# EAGLE design Main Board (EAGLE 8.7.0)

## Sheet 1 of 2
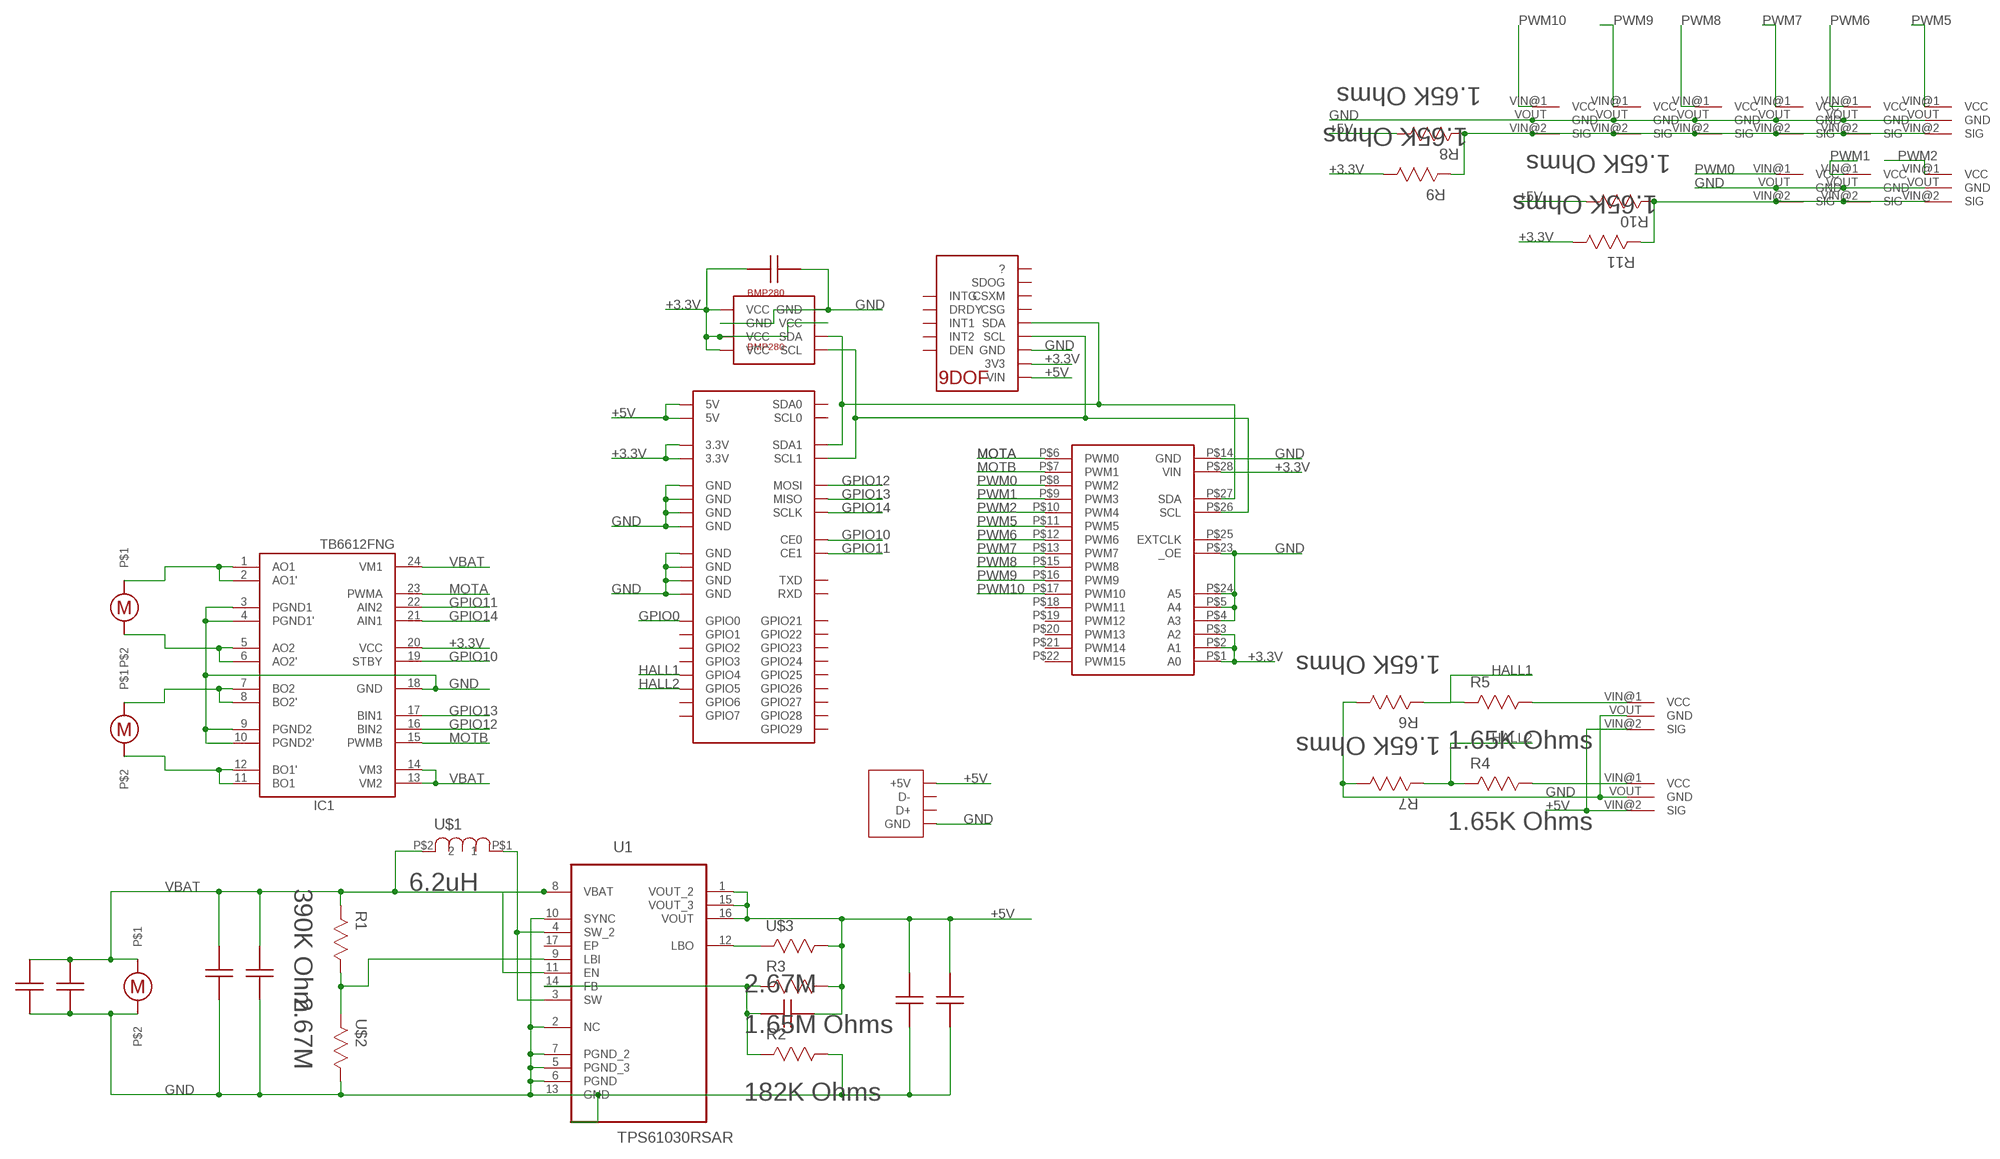
[diagram p0: schematic, sheet 1]

### Parts
IC1  TB6612FNG  [SSOP24]
R1  390K Ohm  CRCW0805390KJNEA  [RESC2013X65N]
R2  182K Ohms  CRCW0805182KFKEA  [RESC2013X65N]
R3  1.65M Ohms  CRCW06031M65FKEA  [RESC1608X60N]
R4  1.65K Ohms  CRCW06031K65FKEA  [RESC1608X60N]
R5  1.65K Ohms  CRCW06031K65FKEA  [RESC1608X60N]
R6  1.65K Ohms  CRCW06031K65FKEA  [RESC1608X60N]
R7  1.65K Ohms  CRCW06031K65FKEA  [RESC1608X60N]
R8  1.65K Ohms  CRCW06031K65FKEA  [RESC1608X60N]
R9  1.65K Ohms  CRCW06031K65FKEA  [RESC1608X60N]
R10  1.65K Ohms  CRCW06031K65FKEA  [RESC1608X60N]
R11  1.65K Ohms  CRCW06031K65FKEA  [RESC1608X60N]
U1  TPS61030RSAR  [QFN65P400X400X100-17N]
U$1  6.2uH  SRU1038-6R2Y  [SRU1038-6R2Y]
U$2  2.67M  CRCW04022M67FKED  [RESC1005X40N]
U$3  2.67M  CRCW04022M67FKED  [RESC1005X40N]
U$4  10pF  0603CAP  [0603]
U$5  MOTOR  [MOTOR_PAD]
U$6  9DOF  [9DOF]
U$7  0603CAP  [0603]
U$8  USB_VERTICLE  [USB_VERTICLE]
U$9  0805CAP  [RESC2013X45N]
U$10  0805CAP  [RESC2013X45N]
U$11  PI  [PI_HEADER_SMD]
U$12  220  [220]
U$13  BMP280  [BMP280]
U$14  0603CAP  [0603]
U$15  PJUMP  [JUMPER]
U$16  PJUMP  [JUMPER]
U$17  PJUMP  [JUMPER]
U$18  220  [220]
U$19  220  [220]
U$20  MOTOR  [MOTOR_PAD]
U$21  MOTOR  [MOTOR_PAD]
U$22  PJUMP  [JUMPER]
U$23  PJUMP  [JUMPER]
U$24  PJUMP  [JUMPER]
U$25  PJUMP  [JUMPER]
U$26  PJUMP  [JUMPER]
U$27  PWM  [TSSOP28]
U$28  PJUMP  [JUMPER]
U$29  PJUMP  [JUMPER]
U$30  PJUMP  [JUMPER]

### Nets
+3.3V: IC1.20(VCC) R9.1 R11.1 U$6.P$21(3V3) U$11.3.3V@1(3.3V) U$11.3.3V@17(3.3V) U$13.P$2(VCC) U$13.P$5(VCC) U$13.P$6(VCC) U$13.P$8(VCC) U$14.P$1 U$27.P$1(A0) U$27.P$2(A1) U$27.P$3(A2) U$27.P$28(VIN)
+5V: R3.1 R8.1 R10.1 U1.1(VOUT_2) U1.15(VOUT_3) U1.16(VOUT) U$3.1 U$4.P$2 U$6.P$20(VIN) U$8.VCC(+5V) U$9.1 U$11.5V@2(5V) U$11.5V@4(5V) U$12.P$1 U$15.VIN@2(SIG) U$16.VIN@2(SIG)
GND: IC1.3(PGND1) IC1.4(PGND1') IC1.9(PGND2) IC1.10(PGND2') IC1.18(GND) R2.1 R6.1 R7.1 U1.2(NC) U1.5(PGND_3) U1.6(PGND) U1.7(PGND_2) U1.10(SYNC) U1.13(GND) U$2.1 U$6.P$22(GND) U$7.P$2 U$8.GND@1(GND) U$8.GND@2(GND) U$8.GND@3(GND) U$9.2 U$10.2 U$11.GND@6(GND) U$11.GND@9(GND) U$11.GND@14(GND) U$11.GND@20(GND) U$11.GND@25(GND) U$11.GND@30(GND) U$11.GND@34(GND) U$11.GND@39(GND) U$12.P$2 U$13.P$1(GND) U$13.P$7(GND) U$14.P$2 U$15.VOUT(GND) U$16.VOUT(GND) U$17.VOUT(GND) U$18.P$2 U$19.P$2 U$21.P$2 U$22.VOUT(GND) U$23.VOUT(GND) U$24.VOUT(GND) U$25.VOUT(GND) U$26.VOUT(GND) U$27.P$4(A3) U$27.P$5(A4) U$27.P$14(GND) U$27.P$23(_OE) U$27.P$24(A5) U$28.VOUT(GND) U$29.VOUT(GND) U$30.VOUT(GND)
GPIO0: U$11.GPIO0
GPIO10: IC1.19(STBY) U$11.CE0
GPIO11: IC1.22(AIN2) U$11.CE1
GPIO12: IC1.16(BIN2) U$11.MOSI
GPIO13: IC1.17(BIN1) U$11.MISO
GPIO14: IC1.21(AIN1) U$11.SCLK
HALL1: R5.2 R6.2 U$11.GPIO4
HALL2: R4.2 R7.2 U$11.GPIO5
MOTA: IC1.23(PWMA) U$27.P$6(PWM0)
MOTB: IC1.15(PWMB) U$27.P$7(PWM1)
N$1: R1.1 U1.9(LBI) U$2.2
N$2: U1.3(SW) U1.4(SW_2) U$1.P$1
N$3: R8.2 R9.2 U$17.VIN@2(SIG) U$22.VIN@2(SIG) U$23.VIN@2(SIG) U$24.VIN@2(SIG) U$25.VIN@2(SIG) U$26.VIN@2(SIG)
N$5: R5.1 U$15.VIN@1(VCC)
N$6: R4.1 U$16.VIN@1(VCC)
N$7: U1.12(LBO) U$3.2
N$8: R10.2 R11.2 U$28.VIN@2(SIG) U$29.VIN@2(SIG) U$30.VIN@2(SIG)
N$10: U$6.P$23(SCL) U$11.SCL1 U$13.P$4(SCL) U$27.P$26(SCL)
N$11: R2.2 R3.2 U1.14(FB) U$4.P$1
N$12: U$6.P$24(SDA) U$11.SDA1 U$13.P$3(SDA) U$27.P$27(SDA)
N$16: IC1.1(AO1) IC1.2(AO1') U$20.P$1
N$17: IC1.5(AO2) IC1.6(AO2') U$20.P$2
N$18: IC1.7(BO2) IC1.8(BO2') U$5.P$1
N$19: IC1.11(BO1) IC1.12(BO1') U$5.P$2
PWM0: U$27.P$8(PWM2) U$30.VIN@1(VCC)
PWM1: U$27.P$9(PWM3) U$29.VIN@1(VCC)
PWM2: U$27.P$10(PWM4) U$28.VIN@1(VCC)
PWM5: U$17.VIN@1(VCC) U$27.P$11(PWM5)
PWM6: U$22.VIN@1(VCC) U$27.P$12(PWM6)
PWM7: U$23.VIN@1(VCC) U$27.P$13(PWM7)
PWM8: U$24.VIN@1(VCC) U$27.P$15(PWM8)
PWM9: U$25.VIN@1(VCC) U$27.P$16(PWM9)
PWM10: U$26.VIN@1(VCC) U$27.P$17(PWM10)
VBAT: IC1.13(VM2) IC1.14(VM3) IC1.24(VM1) R1.2 U1.8(VBAT) U1.11(EN) U$1.P$2 U$7.P$1 U$10.1 U$18.P$1 U$19.P$1 U$21.P$1
Unconnected: U1.17(EP) U$6.P$15(DEN) U$6.P$16(INT2) U$6.P$17(INT1) U$6.P$18(DRDY) U$6.P$19(INTG) U$6.P$25(CSG) U$6.P$26(CSXM) U$6.P$27(SDOG) U$6.P$28(?) U$8.D+ U$8.D- U$11.GPIO1 U$11.GPIO2 U$11.GPIO3 U$11.GPIO6 U$11.GPIO7 U$11.GPIO21 U$11.GPIO22 U$11.GPIO23 U$11.GPIO24 U$11.GPIO25 U$11.GPIO26 U$11.GPIO27 U$11.GPIO28 U$11.GPIO29 U$11.RXD U$11.SCL0 U$11.SDA0 U$11.TXD U$27.P$18(PWM11) U$27.P$19(PWM12) U$27.P$20(PWM13) U$27.P$21(PWM14) U$27.P$22(PWM15) U$27.P$25(EXTCLK)

## Sheet 2 of 2

## Library data of the parts
IC1 = Adafruit:TB6612FNG: TB6612FNG MOS dual H-bridge motor driver, 1.2A current 3.2A peak 3 or 5v logic and 3-15v motor
R1 = Vishay:CRCW0805390KJNEA: RESISTOR, 0805; MPN: CRCW0805390KJNEA; OC_FARNELL: -; OC_NEWARK: 59M6896; SUPPLIER: VISHAY DALE ELECTRONICS; TOLERANCE: ±5%; WATTAGE: 0.125 W
R2 = Vishay:CRCW0805182KFKEA: RESISTOR, 0805; MPN: CRCW0805182KFKEA; OC_FARNELL: 1652932; OC_NEWARK: 52K9931; SUPPLIER: Vishay; TOLERANCE: ±1%; WATTAGE: 0.125 W
R3 = Vishay:CRCW06031M65FKEA: RESISTOR, 0603; MPN: CRCW06031M65FKEA; OC_FARNELL: 1570712; OC_NEWARK: 89M6723; SUPPLIER: Vishay; TOLERANCE: ±1%; WATTAGE: 0.1 W
R4-R11 = Vishay:CRCW06031K65FKEA: RESISTOR, 0603; MPN: CRCW06031K65FKEA; OC_FARNELL: 1151619; OC_NEWARK: 52K8043; SUPPLIER: VISHAY DALE ELECTRONICS; TOLERANCE: ±1%; WATTAGE: 0.1 W
U1 = Texas Instruments:TPS61030RSAR: SYNCHRONOUS BOOST CONVERTER; MPN: TPS61030RSAR; OC_FARNELL: 1813710; OC_NEWARK: 90H4859; PACKAGE: QFN-16; SUPPLIER: Texas Instruments
U$1 = GoatFinder:SRU1038-6R2Y
U$2 U$3 = Vishay:CRCW04022M67FKED
U$4 U$7 U$14 = GoatFinder:0603CAP
U$5 U$20 U$21 = GoatFinder:MOTOR
U$6 = GoatFinder:9DOF
U$8 = GoatFinder:USB_VERTICLE
U$9 U$10 = GoatFinder:0805CAP
U$11 = GoatFinder:PI
U$12 U$18 U$19 = GoatFinder:220
U$13 = GoatFinder:BMP280
U$15-U$17 U$22-U$26 U$28-U$30 = GoatFinder:PJUMP
U$27 = GoatFinder:PWM

## Board
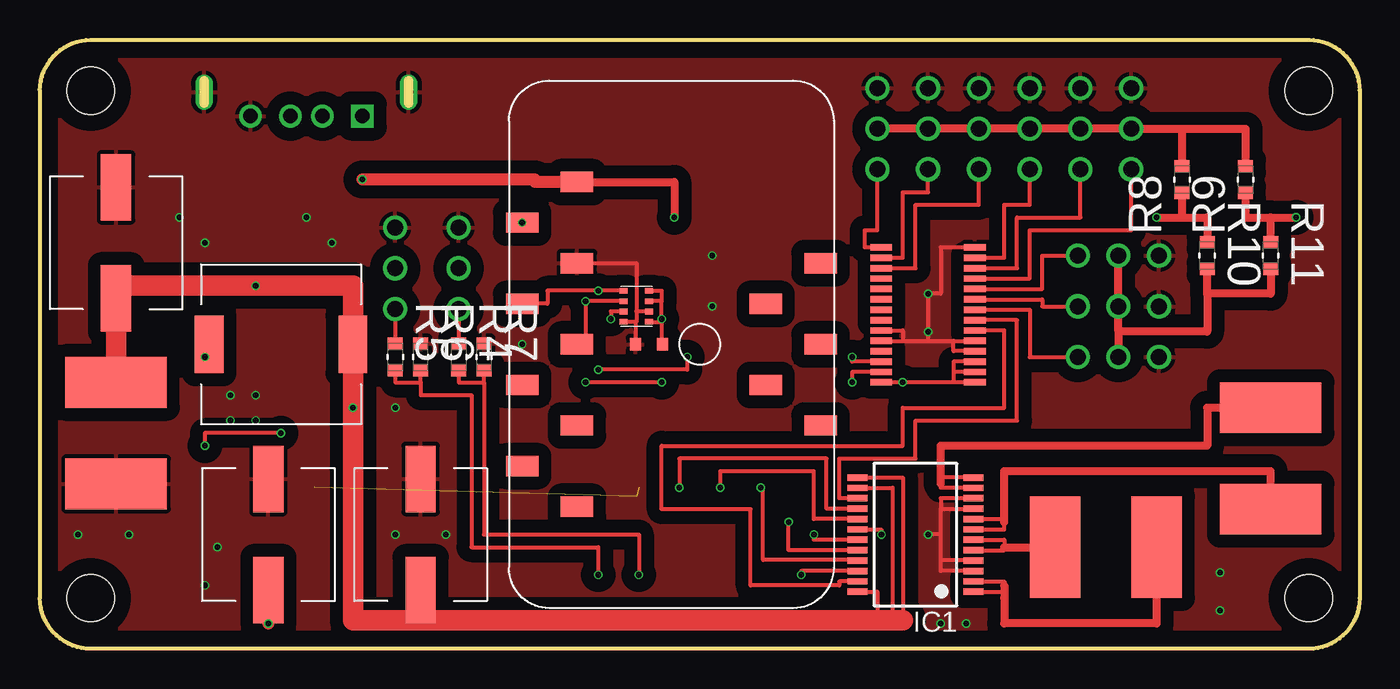
[diagram p1: board, top side]
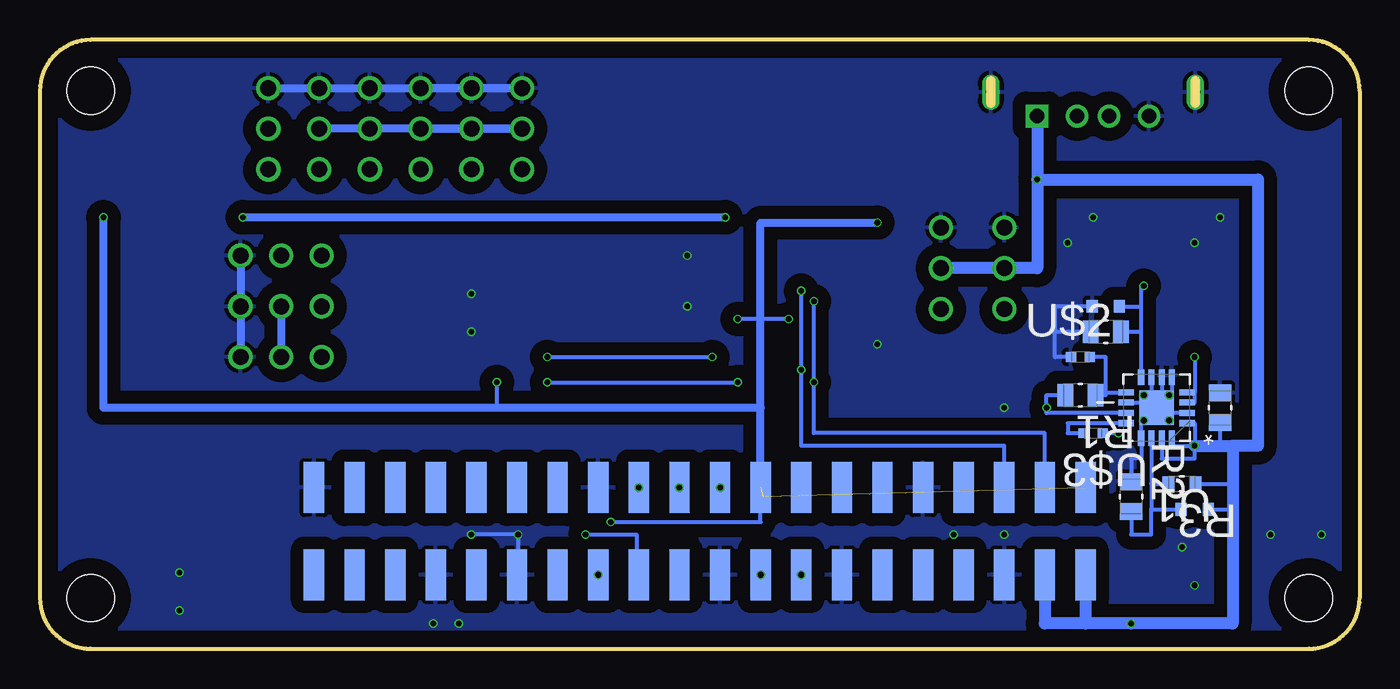
[diagram p2: board, bottom side, seen from below]

Size 82.55 x 38.1 mm. Coordinates in mm from the lower left corner, seen from the top.
Outline: 3.17,38.1 79.38,38.1 arc-90 82.55,34.92 82.55,3.18 arc-90 79.38,0 3.17,0 arc-90 0,3.18 0,34.92 arc-90 3.17,38.1
Copper layers (1*16): Top 0.035mm / dielectric 1.5mm / Bottom 0.035mm
Design rules "default *": minimum track width 6mil, minimum drill 10mil, track to track 6mil, track to pad 6mil, pad to pad 6mil, via to via 6mil, smd to smd 6mil, copper to edge 40mil, drill to drill 6mil, minimum pad ring 10mil, minimum via ring 1mil, stop-mask expansion 4mil, vias tented up to drill 0mil, thermal gap 10mil
Holes 2.95 mm at 79.38,34.92 79.38,3.18 3.17,3.18 3.17,34.92

### Footprints (pad centres in the part's own frame; a part is rotated, then mirrored left to right if it is on the bottom)
SSOP24 = smd 0.4 x 1.25: 1 -3.575,-3.625; 2 -2.925,-3.625; 3 -2.275,-3.625; 4 -1.625,-3.625; 5 -0.975,-3.625; 6 -0.325,-3.625; 7 0.325,-3.625; 8 0.975,-3.625; 9 1.625,-3.625; 10 2.275,-3.625; 11 2.925,-3.625; 12 3.575,-3.625; 13 3.575,3.625; 14 2.925,3.625; 15 2.275,3.625; 16 1.625,3.625; 17 0.975,3.625; 18 0.325,3.625; 19 -0.325,3.625; 20 -0.975,3.625; 21 -1.625,3.625; 22 -2.275,3.625; 23 -2.925,3.625; 24 -3.575,3.625
RESC2013X65N = smd 1.016 x 1.397: 1 -0.94,0; 2 0.94,0
RESC1608X60N = smd 0.762 x 0.94: 1 -0.838,0; 2 0.838,0
QFN65P400X400X100-17N = smd 0.965 x 0.381: 1 -1.905,0.965; 2 -1.905,0.33; 3 -1.905,-0.33; 4 -1.905,-0.965; 9 1.905,-0.965; 10 1.905,-0.33; 11 1.905,0.33; 12 1.905,0.965 | smd 0.381 x 0.965: 5 -0.965,-1.905; 6 -0.33,-1.905; 7 0.33,-1.905; 8 0.965,-1.905; 13 0.965,1.905; 14 0.33,1.905; 15 -0.33,1.905; 16 -0.965,1.905 | smd 2.159 x 2.159: 17 0,0
SRU1038-6R2Y = smd 1.8 x 3.6: P$1 -4.5,0; P$2 4.5,0
RESC1005X40N = smd 0.66 x 0.61: 1 -0.584,0; 2 0.584,0
0603 = smd 0.7 x 0.8: P$1 0.85,0; P$2 -0.85,0
MOTOR_PAD = smd 6.35 x 3.175: P$1 0,-3.175; P$2 0,3.175
9DOF = smd 1.27 x 2.03: P$15 -5.08,7.557; P$16 -2.54,4.127; P$17 0,7.557; P$18 2.54,4.127; P$19 5.08,7.557; P$20 -10.16,-7.683; P$21 -7.62,-11.113; P$22 -5.08,-7.683; P$23 -2.54,-11.113; P$24 0,-7.683; P$25 2.54,-11.113; P$26 5.08,-7.683; P$27 7.62,-11.113; P$28 10.16,-7.683
USB_VERTICLE = drill 0.92: D+ -1,0; D- 1,0; GND@1 -3.5,0 | drill 0.6 long: GND@2 -6.4,1.5; GND@3 6.4,1.5 | drill 0.92 square: VCC 3.5,0
RESC2013X45N = smd 1.016 x 1.397: 1 -0.94,0; 2 0.94,0
PI_HEADER_SMD = smd 1.27 x 3.175 bottom: 3.3V@1 -24.13,2.54; 3.3V@17 -3.81,2.54; 5V@2 -24.13,-2.921; 5V@4 -21.59,-2.921; CE0 3.81,-2.921; CE1 6.35,-2.921; GND@6 -19.05,-2.921; GND@9 -13.97,2.54; GND@14 -8.89,-2.921; GND@20 -1.27,-2.921; GND@25 6.35,2.54; GND@30 11.43,-2.921; GND@34 16.51,-2.921; GND@39 24.13,2.54; GPIO0 -11.43,2.54; GPIO1 -11.43,-2.921; GPIO2 -8.89,2.54; GPIO3 -6.35,2.54; GPIO4 -6.35,-2.921; GPIO5 -3.81,-2.921; GPIO6 1.27,-2.921; GPIO7 -16.51,2.54; GPIO21 11.43,2.54; GPIO22 13.97,2.54; GPIO23 16.51,2.54; GPIO24 19.05,2.54; GPIO25 21.59,2.54; GPIO26 13.97,-2.921; GPIO27 19.05,-2.921; GPIO28 21.59,-2.921; GPIO29 24.13,-2.921; MISO 1.27,2.54; MOSI -1.27,2.54; RXD -13.97,-2.921; SCL0 8.89,-2.921; SCL1 -19.05,2.54; SCLK 3.81,2.54; SDA0 8.89,2.54; SDA1 -21.59,2.54; TXD -16.51,-2.921
220 = smd 4.15 x 1.9: P$1 3.475,0; P$2 -3.475,0
BMP280 = smd 0.5 x 0.35: P$1 0.8,0.975; P$2 0.8,0.325; P$3 0.8,-0.325; P$4 0.8,-0.975; P$5 -0.8,-0.975; P$6 -0.8,-0.325; P$7 -0.8,0.325; P$8 -0.8,0.975
JUMPER = drill 1: VIN@1 0,2.54; VIN@2 0,0; VOUT 0,-2.54
TSSOP28 = smd 0.4 x 1.35: P$1 0,-2.925; P$2 0.65,-2.925; P$3 1.3,-2.925; P$4 1.95,-2.925; P$5 2.6,-2.925; P$6 3.25,-2.925; P$7 3.9,-2.925; P$8 4.55,-2.925; P$9 5.2,-2.925; P$10 5.85,-2.925; P$11 6.5,-2.925; P$12 7.15,-2.925; P$13 7.8,-2.925; P$14 8.45,-2.925; P$15 8.45,2.925; P$16 7.8,2.925; P$17 7.15,2.925; P$18 6.5,2.925; P$19 5.85,2.925; P$20 5.2,2.925; P$21 4.55,2.925; P$22 3.9,2.925; P$23 3.25,2.925; P$24 2.6,2.925; P$25 1.95,2.925; P$26 1.3,2.925; P$27 0.65,2.925; P$28 0,2.925

### Placement (x,y rotation side)
IC1  54.77,7.14 90 top
R1  17.46,15.88 180 bottom
R2  14.29,9.53 270 bottom
R3  11.11,10.32 180 bottom
R4  26.19,18.26 270 top
R5  22.22,18.26 270 top
R6  23.81,18.26 270 top
R7  27.78,18.26 270 top
R8  71.44,29.37 90 top
R9  75.41,29.37 90 top
R10  73.03,24.61 270 top
R11  76.99,24.61 270 top
U1  12.7,15.08 180 bottom
U$1  15.08,19.05 0 top
U$2  17.46,18.26 0 bottom
U$3  16.67,13.49 180 bottom
U$4  10.32,8.73 180 bottom
U$5  76.99,11.91 0 top
U$6  41.27,19.05 270 top
U$7  15.88,21.43 0 bottom
U$8  16.67,33.34 0 top
U$9  8.73,15.08 90 bottom
U$10  15.88,19.84 180 bottom
U$11  41.27,7.55 0 top
U$12  14.29,7.14 270 top
U$13  37.31,21.43 180 top
U$14  38.1,19.05 0 top
U$15  22.22,23.81 180 top
U$16  26.19,23.81 180 bottom
U$17  68.26,32.54 180 top
U$18  4.76,25.4 270 top
U$19  23.81,7.14 270 top
U$20  66.67,6.35 90 top
U$21  4.76,13.49 180 top
U$22  65.09,32.54 180 top
U$23  61.91,32.54 180 top
U$24  52.39,32.54 180 top
U$25  55.56,32.54 180 top
U$26  58.74,32.54 180 top
U$27  55.56,16.67 90 top
U$28  67.47,24.61 90 top
U$29  67.47,21.43 90 top
U$30  67.47,18.26 90 top

### Tracks (layer width: path | path; a pad name or v marks a point on that pad's centre or on a via)
+3.3V  (via drill 0.35)  (2 unrouted)
  Top 0.254: IC1.20 46.83,6.17 v46.83,7.94 | U$13.P$5 38.89,22.41 38.89,21.76 | 38.89,21.76 U$13.P$6 | U$13.P$8 38.89,20.46 v38.89,20.64 | v38.89,20.64 38.89,21.76 | U$13.P$2 35.72,21.11 v35.72,20.64 | v38.89,20.64 38.89,19.05 U$14.P$1 | U$27.P$1 57.15,16.67 | 57.15,16.67 v53.97,16.67 U$27.P$28 | U$27.P$2 57.15,17.32 | 57.15,17.32 57.15,16.67 | U$27.P$3 57.15,17.97 57.15,17.32
  Top 0.508: R9.1 75.41,26.99 76.99,26.99 | 76.99,26.99 v78.58,26.99 | R11.1 76.99,26.99
  Bottom 0.254: v46.83,7.94 37.46,7.94 U$11.3.3V@17 | 37.46,20.64 37.46,15.08 53.97,15.08 v53.97,16.67 | 37.46,20.64 37.46,26.67 | v35.72,20.64 37.46,20.64 | 37.46,20.64 v38.89,20.64
  Bottom 0.508: U$11.3.3V@17 37.46,15.08 | 37.46,15.08 37.46,26.67 U$6.P$21 | 37.46,15.08 78.58,15.08 v78.58,26.99
  Bottom 0.762: 37.31,9.53 37.46,9.53
  other vias: 30.16,26.67
+5V  (via drill 0.35)
  Top 0.254: v15.08,13.49 10.32,13.49 v10.32,12.7
  Top 0.508: U$6.P$20 39.69,29.21 v39.69,26.99 | v69.85,26.99 71.44,26.99 | 71.44,26.99 73.03,26.99 R10.1 | R8.1 71.44,26.99
  Top 0.762: U$12.P$1 v14.29,1.59 | U$6.P$20 30.96,29.21 30.96,29.37 v20.17,29.37
  Bottom 0.254: U1.16 11.73,12.7 v10.32,12.7 | U1.15 12.37,11.91 10.32,11.91 v10.32,12.7 | U1.1 10.32,14.12 v10.32,12.7 | R3.1 7.94,10.32 | U$4.P$2 7.94,8.73 | U$3.1 v15.08,13.49 | U$9.1 8.73,12.7
  Bottom 0.508: v39.69,26.99 v69.85,26.99
  Bottom 0.762: 17.14,1.59 v14.29,1.59 7.94,1.59 7.94,8.73 7.94,10.32 7.94,12.7 | 17.14,1.59 19.68,1.59 U$11.5V@4 | v10.32,12.7 8.73,12.7 7.94,12.7 | U$11.5V@2 17.14,1.59 | 7.94,12.7 6.35,12.7 6.35,29.37 v20.17,29.37 | U$8.VCC v20.17,29.37 | v20.17,29.37 20.17,23.81 U$15.VIN@2 U$16.VIN@2
GND  (via drill 0.35)
  Top 0.254: IC1.18 52.64,7.47 v52.64,7.14 | U$13.P$7 37.31,21.11 | 37.25,20.46 U$13.P$1 | 37.31,21.11 37.31,20.46 37.25,20.46 | U$6.P$22 37.31,24.13 37.31,21.11 | 37.25,20.46 U$14.P$2 | IC1.10 56.36,9.42 56.36,8.77 | 56.36,8.77 IC1.9 | IC1.4 56.36,5.52 | 56.36,5.52 56.36,7.14 | 56.36,7.14 56.36,8.77 | IC1.3 56.36,4.87 56.36,5.52 | 56.36,7.14 v55.56,7.14 | U$27.P$24 53.97,19.27 | 53.97,19.27 55.56,19.27 | 55.56,19.27 57.15,19.27 | 57.15,19.27 U$27.P$5 | U$27.P$23 53.97,19.92 53.97,19.27 | U$27.P$4 57.15,18.62 57.15,19.27 | 55.56,19.27 v55.56,19.84 v55.56,22.23 56.36,22.23 56.36,25.12 U$27.P$14
  Bottom 0.254: U$11.GND@30 52.64,4.63 v52.64,7.14 v55.56,7.14 | U1.2 11.91,14.75 v11.91,14.29 | U1.10 13.49,15.41 v13.49,15.88 | U1.5 11.73,15.88 v11.91,15.88 | v13.49,14.29 13.66,14.29 U1.13 13.66,11.91 14.29,11.91 R2.1 | U1.6 12.37,15.88 v11.91,15.88 | U1.7 13.03,15.88 v13.49,15.88 | v13.49,14.29 v13.49,15.88 | v13.49,15.88 v11.91,15.88 | v11.91,15.88 v11.91,14.29 | v11.91,14.29 v13.49,14.29 | U$2.1 19.05,18.26 19.05,19.84 | 19.05,19.84 U$10.2 | U$7.P$2 19.05,21.43 19.05,19.84
  Bottom 0.508: U$28.VOUT U$29.VOUT U$30.VOUT | U$17.VOUT U$22.VOUT U$23.VOUT U$24.VOUT U$25.VOUT U$26.VOUT
  other vias: 8.73,26.99 16.67,26.99 18.26,25.4 10.32,25.4 5.56,7.14 2.38,7.14 10.32,3.97 11.11,6.35 22.22,15.08 22.22,7.14 25.4,7.14 56.36,1.59 57.94,1.59 73.82,2.38 73.82,4.76 30.16,19.05 42.07,24.61 42.07,21.43
  pour Top (isolate 0.813): 0,38.1 82.55,38.1 82.55,0 0,0
  pour Bottom (isolate 0.813): 0,38.1 82.55,38.1 82.55,0 0,0
GPIO10  (via drill 0.35)
  Top 0.254: v48.42,7.14 48.42,6.82 IC1.19
  Bottom 0.254: U$11.CE0 45.24,4.63 45.24,7.14 v48.42,7.14
GPIO11  (via drill 0.35)
  Top 0.254: IC1.22 47.62,4.87 U$11.CE1
  other vias: 47.62,4.63
GPIO12  (via drill 0.35)
  Top 0.254: IC1.16 49.21,8.77 49.21,11.91 40,11.91 U$11.MOSI
  other vias: 40,10.09
GPIO13  (via drill 0.35)
  Top 0.254: IC1.17 48.42,8.12 48.42,11.11 42.55,11.11 U$11.MISO
  Bottom 0.254: 42.86,11.11 42.55,11.11 U$11.MISO
  other vias: 42.55,10.09
GPIO14  (via drill 0.35)
  Top 0.254: IC1.21 51.14,5.56 45.24,5.56 45.24,10.09 U$11.SCLK
  other vias: 45.09,10.09
HALL1  (via drill 0.35)
  Top 0.254: R5.2 22.22,16.67 23.81,16.67 | 23.81,16.67 R6.2 | 23.81,16.67 23.81,15.88 26.99,15.88 26.99,6.35 34.92,6.35 U$11.GPIO4
  other vias: 34.92,4.63
HALL2  (via drill 0.35)
  Top 0.254: R4.2 26.19,16.67 27.78,16.67 | 27.78,16.67 R7.2 | 27.78,16.67 27.78,7.14 37.46,7.14 U$11.GPIO5
  other vias: 37.46,4.63
MOTA
  Top 0.254: IC1.23 50.01,4.22 50.01,3.97 44.45,3.97 44.45,8.73 38.89,8.73 38.89,12.7 53.97,12.7 53.97,15.08 60.33,15.08 60.33,19.92 U$27.P$6
MOTB
  Top 0.254: IC1.15 50.01,9.42 50.01,11.91 54.77,11.91 54.77,14.29 61.12,14.29 61.12,20.57 U$27.P$7
N$1
  Bottom 0.254: R1.1 15.88,15.88 15.88,16.05 | 15.88,16.05 U1.9 | 15.88,16.05 15.88,18.26 U$2.2
N$2  (via drill 0.35)
  Top 0.254: v10.32,18.26 U$1.P$1
  Bottom 0.254: U1.3 10.32,15.41 10.32,16.05 | v10.32,18.26 10.32,16.05 | 10.32,16.05 U1.4
N$3
  Top 0.508: 71.44,32.54 U$17.VIN@2 U$22.VIN@2 U$24.VIN@2 | R9.2 75.41,32.54 71.44,32.54 | 71.44,32.54 R8.2
  Bottom 0.508: U$26.VIN@2 U$25.VIN@2 U$24.VIN@2 U$23.VIN@2 U$22.VIN@2
N$5
  Top 0.254: U$15.VIN@1 R5.1
N$6
  Top 0.254: U$16.VIN@1 R4.1
N$7
  Bottom 0.254: U1.12 18.26,14.12 18.26,13.49 U$3.2
N$8
  Top 0.508: R11.2 76.99,22.23 73.03,22.23 | 73.03,22.23 R10.2 | 73.03,22.23 73.03,19.84 67.47,19.84 | 67.47,19.84 U$29.VIN@2 U$28.VIN@2 | 67.47,19.84 U$30.VIN@2
  Bottom 0.508: U$29.VIN@2 U$30.VIN@2
N$10  (via drill 0.35)
  Top 0.254: U$6.P$23 | U$13.P$4 v34.92,22.41 31.75,22.41 31.75,21.59 U$6.P$23 | 30.16,21.43 U$6.P$23 | U$27.P$26 50.8,17.97 v50.8,18.26 | v40.48,18.26 40.48,17.46 v34.92,17.46
  Bottom 0.254: U$11.SCL1 22.22,12.7 34.92,12.7 v34.92,17.46 v34.92,22.41 | v50.8,18.26 49.21,18.26 v40.48,18.26
N$11
  Bottom 0.254: U1.14 13.03,10.32 | 13.03,10.32 R3.2 | 13.03,10.32 13.03,8.73 | 13.03,8.73 U$4.P$1 | R2.2 14.29,7.14 13.03,7.14 13.03,8.73
N$12  (via drill 0.35)
  Top 0.254: U$13.P$3 v34.13,21.76 34.13,19.05 U$6.P$24 | U$27.P$27 50.8,17.32 v50.8,16.67 | v38.89,16.67 v34.13,16.67
  Bottom 0.254: U$11.SDA1 19.68,13.49 34.13,13.49 v34.13,16.67 v34.13,21.76 | v50.8,16.67 v38.89,16.67
N$16
  Top 0.254: IC1.2 60.33,4.22 60.33,3.97 | IC1.1 60.33,3.57 60.33,3.18
  Top 0.508: U$20.P$1 69.85,1.59 60.33,1.59 60.33,3.18 60.33,3.97
N$17
  Top 0.254: IC1.5 60.33,6.17 60.33,6.35 60.33,6.82 IC1.6
  Top 0.508: 60.33,6.35 U$20.P$2
N$18
  Top 0.254: IC1.8 60.33,8.12 60.33,7.94 60.33,7.47 IC1.7
  Top 0.508: 60.33,7.94 60.33,11.11 76.99,11.11 U$5.P$1
N$19
  Top 0.254: IC1.11 56.36,10.07 56.36,10.32 56.36,10.72 IC1.12
  Top 0.508: 56.36,10.32 56.36,12.7 73.03,12.7 73.03,15.08 U$5.P$2
PWM0
  Top 0.254: U$27.P$8 61.91,21.22 61.91,18.26 U$30.VIN@1
PWM1
  Top 0.254: U$27.P$9 62.71,21.87 62.71,21.43 U$29.VIN@1
PWM2
  Top 0.254: U$27.P$10 62.71,22.52 62.71,24.61 U$28.VIN@1
PWM5
  Top 0.254: U$27.P$11 61.91,23.17 61.91,26.19 68.26,26.19 U$17.VIN@1
PWM6
  Top 0.254: U$27.P$12 61.12,23.82 | 61.12,23.82 61.12,23.81 | 61.12,23.82 61.12,26.99 65.09,26.99 U$22.VIN@1
PWM7
  Top 0.254: U$27.P$13 60.33,24.47 60.33,27.78 61.91,27.78 U$23.VIN@1
PWM8
  Top 0.254: U$27.P$15 51.59,25.12 51.59,26.19 52.39,26.19 U$24.VIN@1
PWM9
  Top 0.254: U$27.P$16 53.97,24.47 53.97,28.58 55.56,28.58 U$25.VIN@1
PWM10
  Top 0.254: U$27.P$17 54.77,23.82 | 54.77,23.82 54.77,23.81 | 54.77,23.82 54.77,27.78 58.74,27.78 U$26.VIN@1
VBAT  (via drill 0.35)
  Top 0.254: IC1.24 52.39,3.57 52.39,1.78 | IC1.14 53.34,10.07 53.34,1.78 | IC1.13 53.97,10.72 53.97,1.78 | U$19.P$1 23.81,1.78
  Top 1.27: U$21.P$1 U$18.P$1 4.76,22.72 v13.49,22.72 19.58,22.72 U$1.P$2 v19.58,15.08 19.58,1.78 23.81,1.78 52.39,1.78 53.34,1.78 53.97,1.78
  Bottom 0.254: U1.8 13.66,19.84 | 13.66,19.84 13.66,21.43 | U$10.1 13.66,19.84 | U$7.P$1 13.66,21.43 | 13.66,21.43 13.66,22.72 v13.49,22.72 | U1.11 19.58,14.75 v19.58,15.08 19.58,15.88 R1.2

### Text on the board
tGlue: GND | Vin | GoatFinder V1 | 8 | 9 | 10 | 7 | 6 | 5 | 5V | 3V | 4 | 3 | 2 | Vin | GND | + | - | 1 | 0
bGlue: GoatFinder V1